# Altium schematic sheet Measuring.SchDoc
size B; SheetNumber: 2; SheetTotal: 2
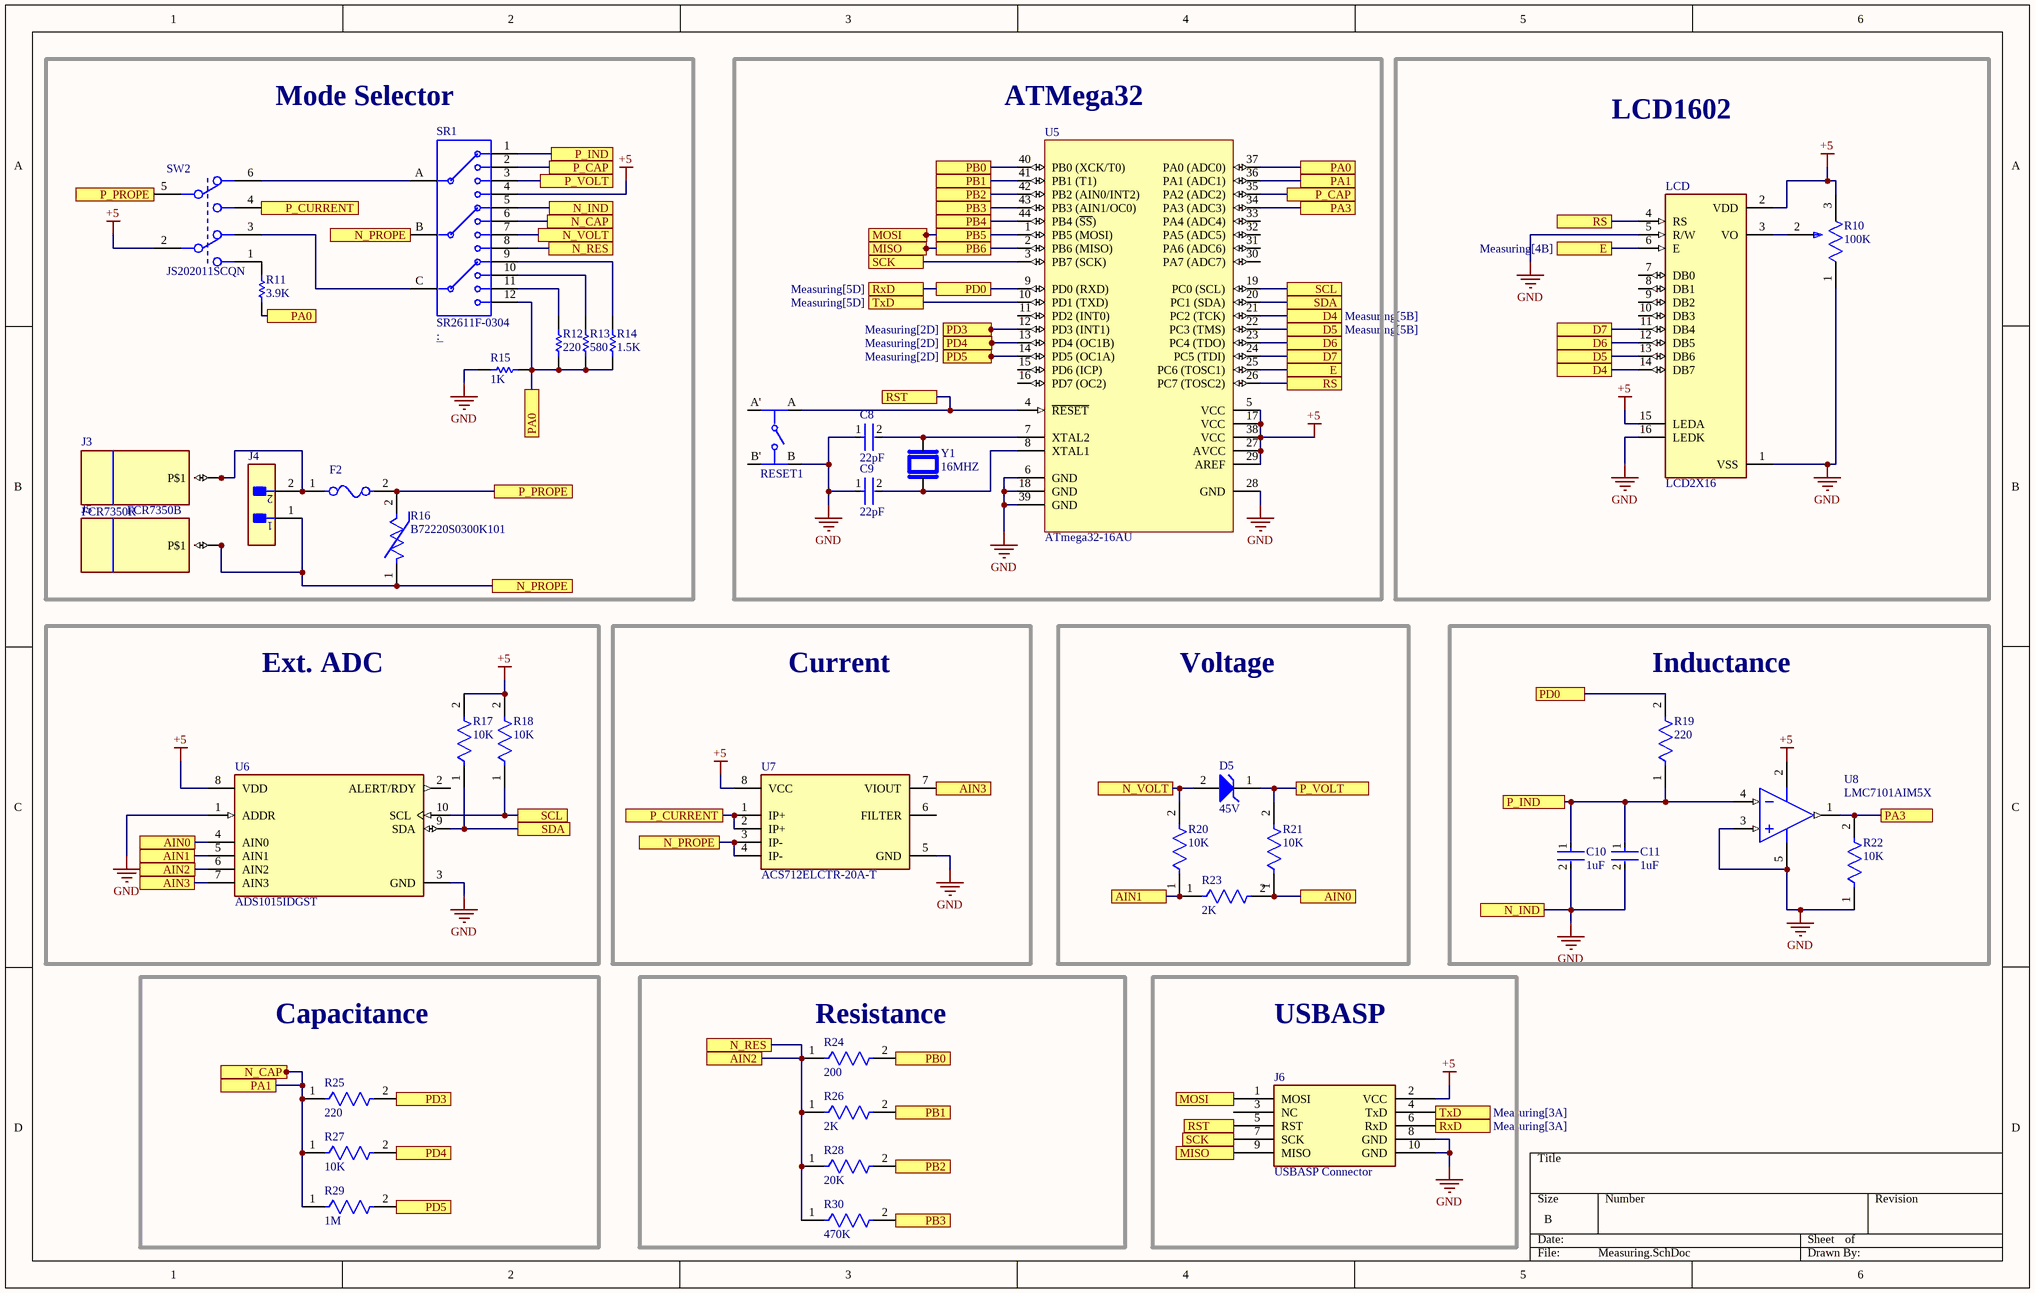
[diagram p0: Measuring.SchDoc]

## Parts
C8  22pF  [FP-C0603C-CF-MFG]
C9  22pF  [FP-C0603C-CF-MFG]
C10  1uF  [FP-0603-L_1_6_0_1-W_0_8_0-IPC_A]
C11  1uF  [FP-0603-L_1_6_0_1-W_0_8_0-IPC_A]
D5  45V  [ONSC-SOD-123-2-425-04_V]
F2  0154004.DR  [FP-0154-MFG]  (value not drawn)
J3  FCR7350R  [FCR7350R]
J4  B2B-XH-A(LF)(SN)  [FP-B2B-XH-A_LF_SN-MFG]  (value not drawn)
J5  FCR7350B  [FCR7350B]
J6  USBASP Connector  [SHDR10W99P254_2X5_2032X889X927P]
LCD  LCD2X16  [LCD_LCD2X16]
R10  100K  [FP-3269W-MFG]
R11  3.9K  [RESC1608X55X25ML10T15]
R12  220  [RESC1608X55X25ML10T15]
R13  580  [RESC1608X55X25ML10T15]
R14  1.5K  [RESC1608X55X25ML10T15]
R15  1K  [RESC1608X55X25ML10T15]
R16  B72220S0300K101  [FP-B72220S0-MFG]
R17  10K  [FP-RC0603-0_55-IPC_C]
R18  10K  [FP-RC0603-0_55-IPC_C]
R19  220  [FP-RC0603-0_55-IPC_C]
R20  10K  [FP-RC0603-0_55-IPC_C]
R21  10K  [FP-RC0603-0_55-IPC_C]
R22  10K  [FP-RC0603-0_55-IPC_C]
R23  2K  [FP-RC0603-0_55-IPC_C]
R24  200  [FP-RC0603-0_55-IPC_C]
R25  220  [FP-RC0603-0_55-IPC_C]
R26  2K  [FP-RC0603-0_55-IPC_C]
R27  10K  [FP-RC0603-0_55-IPC_C]
R28  20K  [FP-RC0603-0_55-IPC_C]
R29  1M  [FP-RC0603-0_55-IPC_C]
R30  470K  [FP-RC0603-0_55-IPC_C]
RESET1  EVQ-Q2B02W  [FP-EVQ-Q2B02W-MFG]  (value not drawn)
SR1  SR2611F-0304  [SW_A30403RNCQ]
SW2  JS202011SCQN  [FP-JS202011SCQN-MFG]
U5  ATmega32-16AU  [44A_N]
U6  ADS1015IDGST  [FP-DGS0010A-MFG]
U7  ACS712ELCTR-20A-T  [FP-LC-8-IPC_C]
U8  LMC7101AIM5X  [DBV0005A_L]
Y1  16MHZ  [XTAL_NX5032GA-16.000000MHZ-LN-CD-1]

## Blocks framed on the sheet
Mode Selector: F2 J3-J5 R11-R16 SR1 SW2
ATMega32: C8 C9 RESET1 U5 Y1
LCD1602: LCD R10
Ext. ADC: R17 R18 U6
Current: U7
Voltage: D5 R20 R21 R23
Inductance: C10 C11 R19 R22 U8
Capacitance: R25 R27 R29
Resistance: R24 R26 R28 R30
USBASP: J6

## Ports
AIN0 (see Measuring[1C]), AIN0 (see Measuring[4C]), AIN1 (see Measuring[1C]), AIN1 (see Measuring[4C]), AIN2 (see Measuring[1C]), AIN2 (see Measuring[3D]), AIN3 (see Measuring[1C]), AIN3 (see Measuring[3C]), D4 (see Measuring[4A]), D4 (see Measuring[5B]), D5 (see Measuring[4B]), D5 (see Measuring[5B]), D6 (see Measuring[4B]), D6 (see Measuring[5B]), D7 (see Measuring[4B]), D7 (see Measuring[5B]), E (see Measuring[4B]), E (see Measuring[5A]), MISO (see Measuring[3A]), MISO (see Measuring[4D]), MOSI (see Measuring[3A]), MOSI (see Measuring[4D]), N_CAP (see Measuring[1D]), N_CAP (see Measuring[2A]), N_IND (see Measuring[2A]), N_IND (see Measuring[5C]), N_PROPE (see Measuring[1A], Measuring[2B]), N_PROPE (see Measuring[1A], Measuring[2C]), N_PROPE (see Measuring[2B], Measuring[2C]), N_RES (see Measuring[2A]), N_RES (see Measuring[3D]), N_VOLT (see Measuring[2A]), N_VOLT (see Measuring[4C]), P_CAP (see Measuring[2A]), P_CAP (see Measuring[4A]), P_CURRENT (see Measuring[1A]), P_CURRENT (see Measuring[2C]), P_IND (see Measuring[2A]), P_IND (see Measuring[5C]), P_PROPE (see Measuring[1A]), P_PROPE (see Measuring[2B]), P_VOLT (see Measuring[2A]), P_VOLT (see Measuring[4C]), PA0 (see Measuring[1A], Measuring[2B]), PA0 (see Measuring[1A], Measuring[4A]), PA0 (see Measuring[2B], Measuring[4A]), PA1 (see Measuring[1D]), PA1 (see Measuring[4A]), PA3 (see Measuring[4A]), PA3 (see Measuring[6C]), PB0 (see Measuring[3A]), PB0 (see Measuring[3D]), PB1 (see Measuring[3A]), PB1 (see Measuring[3D]), PB2 (see Measuring[3A]), PB2 (see Measuring[3D]), PB3 (see Measuring[3A]), PB3 (see Measuring[3D]), PB4, PB5, PB6, PD0 (see Measuring[3A]), PD0 (see Measuring[5C]), PD3 (see Measuring[2D]), PD3 (see Measuring[3B]), PD4 (see Measuring[2D]), PD4 (see Measuring[3B]), PD5 (see Measuring[2D]), PD5 (see Measuring[3B]), RS (see Measuring[4B]), RS (see Measuring[5A]), RST (see Measuring[3B]), RST (see Measuring[4D]), RxD (see Measuring[3A]), RxD (see Measuring[5D]), SCK (see Measuring[3A]), SCK (see Measuring[4D]), SCL (see Measuring[2C]), SCL (see Measuring[4A]), SDA (see Measuring[2C]), SDA (see Measuring[4A]), TxD (see Measuring[3A]), TxD (see Measuring[5D])

## Nets
+5: J6.2(VCC) LCD.2(VDD) LCD.15(LEDA) R10.3(CW) R17.2 R18.2 SR1.4 SW2.2 U5.5(VCC) U5.17(VCC) U5.27(AVCC) U5.29(AREF) U5.38(VCC) U6.8(VDD) U7.8(VCC) U8.2(V+)
GND: C8.1 C9.1 C10.2 C11.2 J6.8(GND) J6.10(GND) LCD.1(VSS) LCD.5(R/W) LCD.16(LEDK) R10.1(CCW) R15.1 R22.1 RESET1.B SR1.5 U5.6(GND) U5.18(GND) U5.28(GND) U5.39(GND) U6.1(ADDR) U6.3(GND) U7.5(GND) U8.3(IN+) U8.5(V-) ; port N_IND
AIN0: R21.1 R23.2 U6.4(AIN0) ; port AIN0
AIN1: R20.1 R23.1 U6.5(AIN1) ; port AIN1
AIN2: R24.1 R26.1 R28.1 R30.1 SR1.8 U6.6(AIN2) ; port N_RES, port AIN2
AIN3: U6.7(AIN3) U7.7(VIOUT) ; port AIN3
D4: LCD.14(DB7) U5.21(PC2_(TCK)) ; port D4
D5: LCD.13(DB6) U5.22(PC3_(TMS)) ; port D5
D6: LCD.12(DB5) U5.23(PC4_(TDO)) ; port D6
D7: LCD.11(DB4) U5.24(PC5_(TDI)) ; port D7
E: LCD.6(E) U5.25(PC6_(TOSC1)) ; port E
MISO: J6.9(MISO) U5.2(PB6_(MISO)) ; port PB6, port MISO
MOSI: J6.1(MOSI) U5.1(PB5_(MOSI)) ; port PB5, port MOSI
N_CAP: R25.1 R27.1 R29.1 SR1.6 U5.36(PA1_(ADC1)) ; port N_CAP, port PA1
N_PROPE: J4.1 J5.P$1 J5.P$2(P$1) J5.P$3(P$1) J5.P$4(P$1) J5.P$5(P$1) R16.1 SR1.B U7.3(IP-) U7.4(IP-) ; port N_PROPE
N_VOLT: D5.2(A) R20.2 SR1.7 ; port N_VOLT
P_CAP: SR1.2 U5.35(PA2_(ADC2)) ; port P_CAP
P_CURRENT: SW2.4 U7.1(IP+) U7.2(IP+) ; port P_CURRENT
P_IND: C10.1 C11.1 R19.1 SR1.1 U8.4(IN-) ; port P_IND
P_PROPE: F2.2 R16.2 SW2.5 ; port P_PROPE
P_VOLT: D5.1(K) R21.2 SR1.3 ; port P_VOLT
PA0: R11.2 R12.2 R13.2 R14.2 R15.2 SR1.12 U5.37(PA0_(ADC0)) ; port PA0
PA3: R22.2 U5.34(PA3_(ADC3)) U8.1(OUT) ; port PA3
PB0: R24.2 U5.40(PB0_(XCK/T0)) ; port PB0
PB1: R26.2 U5.41(PB1_(T1)) ; port PB1
PB2: R28.2 U5.42(PB2_(AIN0/INT2)) ; port PB2
PB3: R30.2 U5.43(PB3_(AIN1/OC0)) ; port PB3
PB4: U5.44(PB4_(~{SS})) ; port PB4
PD0: J6.6(RxD) R19.2 U5.9(PD0_(RXD)) ; port PD0, port RxD
PD3: R25.2 U5.12(PD3_(INT1)) ; port PD3
PD4: R27.2 U5.13(PD4_(OC1B)) ; port PD4
PD5: R29.2 U5.14(PD5_(OC1A)) ; port PD5
RS: LCD.4(RS) U5.26(PC7_(TOSC2)) ; port RS
RST: J6.5(RST) RESET1.A U5.4(~{RESET}) ; port RST
SCK: J6.7(SCK) U5.3(PB7_(SCK)) ; port SCK
SCL: R18.1 U5.19(PC0_(SCL)) U6.10(SCL) ; port SCL
SDA: R17.1 U5.20(PC1_(SDA)) U6.9(SDA) ; port SDA
TxD: J6.4(TxD) U5.10(PD1_(TXD)) ; port TxD
NetC8_2: C8.2 U5.7(XTAL2) Y1.2
NetC9_2: C9.2 U5.8(XTAL1) Y1.1
NetF2_1: F2.1 J3.P$1 J3.P$2(P$1) J3.P$3(P$1) J3.P$4(P$1) J3.P$5(P$1) J4.2
NetLCD_3: LCD.3(VO) R10.2(WIPER)
NetR11_1: R11.1 SW2.1
NetR12_1: R12.1 SR1.11
NetR13_1: R13.1 SR1.10
NetR14_1: R14.1 SR1.9
NetSR1_A: SR1.A SW2.6
NetSR1_C: SR1.C SW2.3

Not connected (* = marked no-connect by the designer): J6 3(NC); LCD 7(DB0) 8(DB1) 9(DB2) 10(DB3); RESET1 A' B'; U5 11(PD2_(INT0)) 15(PD6_(ICP)) 16(PD7_(OC2)) 30(PA7_(ADC7)) 31(PA6_(ADC6)) 32(PA5_(ADC5)) 33(PA4_(ADC4)); U6 2(ALERT/RDY); U7 6(FILTER)

## Library data of the parts
C8 C9 = CMP-2006-03119-3: Cap Ceramic 22pF 50V C0G 5% SMD 0603 125°C Paper T/R; Manufacturer Part Number: C0603C220J5GACTU; Manufacturer: KEMET; Temperature Coefficient: 30ppm/°C; Automotive Grade: Grade 1; Tolerance: 0.05; RoHS: TRUE; Temperature Characteristic: C0G; Capacitance: 22 pF; Device Class L3: Ceramic Capacitors; Digikey Description: Cap Ceramic 22pF 50V C0G 5% SMD 0603 125°C Paper T/R; ComponentLink2URL: https://api.kemet.com/component-edge/download/datasheet/C0603C100J5GACAUTO.pdf; ComponentLink2Description: Datasheet; Automotive: Yes; Temperature: -55°C to +125°C; Temperature Range High: +125°C; Package: C0603C-CF; Device Class L1: Passive Components; Device Class L2: Capacitors; Lead Free: Yes; Value: 22 pF; Category: Cap; Mouser Description: Cap Ceramic 22pF 50V C0G 5% SMD 0603 125°C Paper T/R; Voltage Rating: 50 V; Height: 0.87mm; Material: Ceramic; Temperature Range Low: -55°C; Octopart: https://octopart.com/c0603c220j5gactu-kemet-98525
C10 C11 = CMP-2000-05447-3: None; Tolerance: 10%; Voltage Rating: 50V; Dielectric: X5R; Height: 0.8mm; Depth: 0.8mm; Number of Pins: 2; Length: 1.6mm; Thickness: 0.035inch; Contact Plating: Nickel; Radiation Hardening: No; Package Quantity: 1; Case/Package: 0603; Capacitance: 1uF; Halogen Free: Halogen Free; RoHS Compliant: Yes; Termination: SMD/SMT; Max Operating Temperature: 85°C; Min Operating Temperature: -55°C; Case Code (Metric): 1608; Construction: Flat; Voltage Rating (DC): 50V; Packaging: Tape and Reel; Series: M; Case Code (Imperial): 0603; Width: 0.031inch; Mount: Surface Mount
D5 = CMP-1060-00318-1: Zener Voltage Regulator, 500 mW, 2-Pin SOD-123, Pb-Free, Tape and Reel; Manufacturer: On Semiconductor; PartNumber: MMSZ4713T1G; P Max (W): 0.5; VZ Typ (V): 30; PackageVersion: Rev. G, 10/2009; Mounting Technology: Surface Mount; ComponentLink3URL: http://www.onsemi.com/pub_link/Collateral/425-04.PDF; ComponentLink3Description: Package Specification; ComponentLink1Description: Manufacturer URL; PackageReference: SOD-123-2-425-04; ComponentLink2Description: Datasheet; DatasheetVersion: Rev. 9; RoHS: Pb-Free; Packing: Tape and Reel; ComponentLink2URL: http://www.onsemi.com/pub_link/Collateral/MMSZ4678T1-D.PDF; ComponentLink1URL: http://www.onsemi.com/; PackageDescription: 2-Pin SOD, Body 1.6 x 2.69 mm
F2 = CMP-08605-000003-1: FUSE BRD MNT 4A 125VAC/VDC 2SMD; Manufacturer: Littelfuse; Fuse Blow Speed: Fast; Max Fuse Ac Voltage: 125V; Lead Free: Yes; Device Class L3: unset; Manufacturer Part Number: 0154004.DR; Device Class L2: Fuses; Package: 0154; ComponentLink2Description: Datasheet; Temperature Range Low: -55°C; Temperature Range High: +125°C; Device Class L1: Circuit Protection; Height: 3.81mm; Temperature: -55°C to +125°C; Mouser Description: Surface Mount Fuses Fuseblock w/ fuse 4A OMNI BLOK 154; Automotive: No; Digikey Description: FUSE BRD MNT 4A 125VAC/VDC 2SMD; RoHS: TRUE; Category: Fuse; Fuse Current: 4A; Max Fuse Dc Voltage: 125V; ComponentLink2URL: https://www.littelfuse.com/~/media/electronics/datasheets/fuses/littelfuse_fuse_154_154t_154l_154tl_datasheet.pdf.pdf; Octopart: https://octopart.com/0154004.dr-littelfuse-565861
J3 = FCR7350R: Banana Jack Connector Standard Banana Solder Red; MF: Cliff; SnapEDA_Link: https://www.snapeda.com/parts/FCR7350R/Cliff+Electronics/view-part/?ref=snap; Package: None; Value: *; MP: FCR7350R; Check_prices: https://www.snapeda.com/parts/FCR7350R/Cliff+Electronics/view-part/?ref=eda
J4 = CMP-2000-05888-3: CONN HEADER VERT 2POS 2.5MM; Current Rating: 3A; Voltage Rating: 250V; Number of Contacts: 2; Contact Resistance: 20mR; Wire/Cable Gauge: 22AWG; Insulation Resistance: 1GR; Connector Type: Male Pin; Packaging: Bulk; Contact Material: Brass; Lead Free: Lead Free; Orientation: Straight; Contact Plating: Tin; Max Current Rating: 3A; Termination: Solder; Fastening Type: Detent; Depth: 5.75mm; Housing Material: Polyamide; REACH SVHC: No SVHC; Series: XH; Voltage Rating (AC): 250V; Number of Positions: 2; Color: Natural; Contact Type: Male Pin; Max Voltage Rating (DC): 250V; Pitch: 2.5mm; Lead Pitch: 2.5mm; Mount: Through Hole; Max Operating Temperature: 85°C; Length: 7.4mm; Max Voltage Rating (AC): 250V; Min Operating Temperature: -25°C; Number of Rows: 1; Housing Color: White
J5 = FCR7350B: Banana Jack Connector Standard Banana Solder Black; MF: Cliff; MP: FCR7350R; SnapEDA_Link: https://www.snapeda.com/parts/FCR7350R/Cliff+Electronics/view-part/?ref=snap; Package: None; Value: *; Check_prices: https://www.snapeda.com/parts/FCR7350R/Cliff+Electronics/view-part/?ref=eda
J6 = USBASP Connector: Connector; Manufacturer_Name: Molex; Manufacturer_Part_Number: 70246-1001; Datasheet Link: http://www.molex.com/pdm_docs/sd/702461001_sd.pdf; Height: 9.27mm; Mouser Part Number: 538-70246-1001; Mouser Price/Stock: https://www.mouser.co.uk/ProductDetail/Molex/70246-1001?qs=L7RdmAxh%252BcP9d7Ope9dnAA%3D%3D
LCD = LCD2X16: Display; Display: LCD 2x16 characters (blue backlight); Price: None; Value: *; MP: LCD2X16; Package: None; Availability: Unavailable
R10 = CMP-07234-000021-1: TRIMMER 100K OHM 0.25W SMD; Manufacturer: Bourns; Manufacturer Part Number: 3269W-1-104LF; Temperature Coefficient: 100ppm/°C; Tolerance: 10%; Resistance: 100kΩ; Value: 100kΩ; Composition: Cermet; Height: 8.96mm; ComponentLink2URL: https://www.bourns.com/docs/Product-Datasheets/3269.pdf; Mouser Description: Res Cermet Trimmer 100K Ohm 10% 1/4W 12(Elec)Turn 1.78mm (6.35 X 6.36 X 8.46mm) Gull Wing SMD Tube; ComponentLink2Description: Datasheet; Temperature Range High: +150°C; Temperature: -65°C to +150°C; Series: 3269; Device Class L1: Passive Components; RoHS: TRUE; Octopart: https://octopart.com/3269w-1-104lf-bourns-114162; Temperature Range Low: -65°C; Device Class L2: Resistors; Digikey Description: TRIMMER 100K OHM 0.25W SMD; Power Rating: 0.25W; Device Class L3: Variable Resistors and Potentiometers; Lead Free: Yes; Package: 3269W; Category: Res; Automotive: No
R11-R14 = CMP-2100-03667-1: Chip Resistor, 0 Ohm, +/- 5%, 0.1 W, -55 to 155 degC, 0603 (1608 Metric), RoHS, Tape and Reel; Manufacturer: Yageo; Temperature Coefficient: 200ppm/degreesC; Voltage Rating: 50V; Power Rating: 100mW; Resistance: 1K; Width: 0.8mm; Max Operating Temperature: 155degC; Tolerance: 5%; Package Reference: 0603; Height: 0.45mm; Depth: 0.8mm; Package Description: 2-Pin Surface Mount Device, Body 1.6 x 0.8 mm; Termination: SMD/SMT; Package Quantity: 5000; Case/Package: 0603; Case Code (Imperial): 0603; Radiation Hardening: No; Number of Pins: 2; Length: 1.6mm; Lead Free: LeadFree; Voltage Rating (DC): 50V; Military Standard: Not; Datasheet URL: http://www.yageo.com/NewPortal/yageodocoutput?fileName=/pdf/R-Chip/PYu-RC_Group_51_RoHS_L_5.pdf; Manufacturer URL: http://www.yageo.com/; Packaging: TapeandReel; Case Code (Metric): 1608; Min Operating Temperature: -55degC; Composition: ThickFilm; RoHSCompliant: true; Contact Plating: Tin; Datasheet Version: Rev. 5, 10/2016; REACH SVHC: NoSVHC
R15 = CMP-2100-03667-1: Chip Resistor, 0 Ohm, +/- 5%, 0.1 W, -55 to 155 degC, 0603 (1608 Metric), RoHS, Tape and Reel; Manufacturer: Yageo; Temperature Coefficient: 200ppm/degreesC; Voltage Rating: 50V; Power Rating: 100mW; Width: 0.8mm; Max Operating Temperature: 155degC; Tolerance: 5%; Package Reference: 0603; Height: 0.45mm; Depth: 0.8mm; Package Description: 2-Pin Surface Mount Device, Body 1.6 x 0.8 mm; Termination: SMD/SMT; Package Quantity: 5000; Case/Package: 0603; Case Code (Imperial): 0603; Radiation Hardening: No; Number of Pins: 2; Length: 1.6mm; Lead Free: LeadFree; Voltage Rating (DC): 50V; Military Standard: Not; Datasheet URL: http://www.yageo.com/NewPortal/yageodocoutput?fileName=/pdf/R-Chip/PYu-RC_Group_51_RoHS_L_5.pdf; Resistance: 1K; Manufacturer URL: http://www.yageo.com/; Packaging: TapeandReel; Case Code (Metric): 1608; Min Operating Temperature: -55degC; Composition: ThickFilm; RoHSCompliant: true; Contact Plating: Tin; Datasheet Version: Rev. 5, 10/2016; REACH SVHC: NoSVHC
R16 = CMP-10618-000002-1: VARISTOR 45VAC 2KA DISC 20MM; Manufacturer: EPCOS; Voltage Rating Dc: 38V; Clamping Voltage: 93V; Clamping Current: 20A; Capacitance: 9350pF; Voltage Rating Ac: 30V; Varistor Voltage: 47V; Value: 9350pF; Voltage Tolerance: 10%; ComponentLink2URL: https://www.tdk-electronics.tdk.com/inf/70/db/var/SIOV_Leaded_StandarD.pdf; Category: Res; Device Class L1: Circuit Protection; ComponentLink2Description: Datasheet; Mouser Description: Epcos Standard Series Metal Oxide Varistor 9.35nF 20A; Clamping 93V; Varistor 47V; Device Class L3: unset; Package: B72220S0; Manufacturer Part Number: B72220S0300K101; RoHS: TRUE; Octopart: https://octopart.com/b72220s0300k101-epcos-10532994; Height: 25.5mm; Temperature: -40°C to +105°C; Temperature Range High: +105°C; Temperature Range Low: -40°C; Lead Free: Yes; Digikey Description: VARISTOR 47V 2KA DISC 20MM; Device Class L2: Varistors; Automotive: No
R17 R18 R20 R21 R23-R30 = CMP-2100-03664-2: RES 10K OHM 1% 1/10W 0603; Voltage Rating: 75V; Voltage Rating (DC): 50V; Resistance: 10kR; Power Rating: 100mW; Temperature Coefficient: 100ppm/°C; Depth: 0.8mm; Termination: SMD/SMT; Resistor Type: Thick Film; Series: RC; Construction: Rectangular; Features: Moisture Resistant; Packaging: Tape and Reel; Min Operating Temperature: -55°C; Number of Terminations: 2; Lead Pitch: 0.3mm; RoHS Compliant: Yes; Case/Package: 0603; Resistance Tolerance: 1%; Military Standard: Not; Weight: 7.1E-05oz; Number of Pins: 2; Tolerance: 1%; Length: 1.6mm; Case Code (Imperial): 0603; Lead Free: Lead Free; Width: 0.8mm; Max Power Dissipation: 100mW; Height: 0.45mm; Max Operating Temperature: 155°C; Case Code (Metric): 1608; Size Code: 0603
R19 = CMP-2100-03664-2: RES 10K OHM 1% 1/10W 0603; Voltage Rating: 75V; Voltage Rating (DC): 50V; Resistance: 220R; Power Rating: 100mW; Temperature Coefficient: 100ppm/°C; Depth: 0.8mm; Termination: SMD/SMT; Resistor Type: Thick Film; Series: RC; Construction: Rectangular; Features: Moisture Resistant; Packaging: Tape and Reel; Min Operating Temperature: -55°C; Number of Terminations: 2; Lead Pitch: 0.3mm; RoHS Compliant: Yes; Case/Package: 0603; Resistance Tolerance: 1%; Military Standard: Not; Weight: 7.1E-05oz; Number of Pins: 2; Tolerance: 1%; Length: 1.6mm; Case Code (Imperial): 0603; Lead Free: Lead Free; Width: 0.8mm; Max Power Dissipation: 100mW; Height: 0.45mm; Max Operating Temperature: 155°C; Case Code (Metric): 1608; Size Code: 0603
R22 = CMP-2100-03664-2: RES 10K OHM 1% 1/10W 0603; Voltage Rating: 75V; Voltage Rating (DC): 50V; Resistance: 10KR; Power Rating: 100mW; Temperature Coefficient: 100ppm/°C; Depth: 0.8mm; Termination: SMD/SMT; Resistor Type: Thick Film; Series: RC; Construction: Rectangular; Features: Moisture Resistant; Packaging: Tape and Reel; Min Operating Temperature: -55°C; Number of Terminations: 2; Lead Pitch: 0.3mm; RoHS Compliant: Yes; Case/Package: 0603; Resistance Tolerance: 1%; Military Standard: Not; Weight: 7.1E-05oz; Number of Pins: 2; Tolerance: 1%; Length: 1.6mm; Case Code (Imperial): 0603; Lead Free: Lead Free; Width: 0.8mm; Max Power Dissipation: 100mW; Height: 0.45mm; Max Operating Temperature: 155°C; Case Code (Metric): 1608; Size Code: 0603
RESET1 = CMP-05618-000078-1: SWITCH TACTILE SPST-NO 0.02A 15V; Contact Resistance: 100mR; Illumination Type: Non-Illuminated; Electrical Life: 2000000Cycles; Voltage Rating (AC): 250V; Throw Configuration: SPST; Contact Current Rating: 20mA; Actuator Type: Standard; Switch Function: Off-Mom; Switch Travel: 0.2mm; Operating Force: 0.5N; Actuator Length: 0.7mm; Actuator Color: White; Package Quantity: 1; Min Operating Temperature: -40°C; Voltage Rating (DC): 15V; Mechanical Life: 2000000Cycles; Radiation Hardening: No; Thickness: 1.8mm; Mount: Surface Mount; Current Rating: 20mA; Case/Package: SMD/SMT; Max Operating Temperature: 85°C; Series: EVQQ2; Lead Free: Lead Free; Termination: SMD/SMT; Packaging: Tape and Reel; Orientation: Straight; RoHS Compliant: Yes; Size: 1.8mm; Contact Plating: Silver; Color: White; Max Voltage Rating (DC): 15V
SR1 = SR2611F-0304: Rotary Switch 4 Position 3P4T 2.5A (AC), 350mA (DC) 125VAC Panel Mount, Through Hole; MP: A30403RNCQ; MF: C&K; SnapEDA_Link: https://www.snapeda.com/parts/A30403RNCQ/C&K/view-part/438327/?ref=snap; Availability: Unavailable; Package: None; Price: None; Value: *
SW2 = CMP-2000-05087-3: SWITCH SLIDE DPDT 300MA 6V; Switch Function: On-On; Actuator Type: Standard; Switch Travel: 2mm; Actuator Color: Black; Contact Resistance: 70mR; Electrical Life: 5000Cycles; Actuator Material: Nylon; REACH SVHC: No SVHC; Series: JS; Min Operating Temperature: -20°C; Depth: 7.5mm; Housing Material: Nylon; Voltage Rating (DC): 6V; Max Operating Temperature: 85°C; Contact Current Rating: 300mA; Package Quantity: 1; Contact Plating: Silver; Contact Material: Copper Alloy; Throw Configuration: DPDT; Current Rating: 300mA; Orientation: Vertical; Max Current Rating: 300mA; Max Voltage Rating (DC): 6V; Flammability Rating: UL94 V-2; Length: 9mm; Packaging: Tape and Reel; Mount: Surface Mount; Actuator Length: 2mm; Lead Free: Lead Free; Termination: Gull Wing; Radiation Hardening: No
U5 = CMP-0095-00554-1: 8-bit AVR Microcontroller, 4.5-5.5V, 16MHz, 32KB Flash, 1024 Bytes EEPROM, 2KB SRAM, 44-pin TQFP, Industrial Grade (-40°C to 85°C); ComponentLink1URL: http://www.atmel.com/; Code_JEDEC: MS-026-ACB; PackageDescription: 44-Pin Plastic Thin Profile Quad Flat Pack, 10 x 10 x 1.0 mm Body, 0.8 mm Pitch (TQFP); ComponentLink2Description: ATmega32(L) Datasheet; ComponentLink3URL: http://atmel.com/dyn/resources/prod_documents/2503S.pdf; PackageVersion: revC, Oct-2010; ComponentLink1Description: Manufacturer URL; ComponentLink3Description: ATmega32(L) Summary; ComponentLink2URL: http://atmel.com/dyn/resources/prod_documents/doc2503.pdf; PackageReference: 44A; DatasheetVersion: revQ, Feb-2011
U6 = CMP-0003-00377-3: IC ADC 12BIT SIGMA-DELTA 10VSSOP; Supply Type: Single; Number of Converters: 1; Number of Bits: 12; Number of Inputs: 4; Sampling Rate: 3.3KS/s; Conversion Rate: 3300S/s; Min Supply Voltage: 2V; Interface: I2C; Operating Supply Voltage: 3.3V; Polarity: Bipolar; Nominal Supply Current: 150uA; Integral Nonlinearity (INL): 0.5LSB; Max Power Dissipation: 900uW; Max Supply Voltage (DC): 5.5V; Resolution: 12b; Width: 3mm; Min Operating Temperature: -40°C; Contact Plating: Gold; Number of A/D Converters: 1; Max Operating Temperature: 125°C; Height: 1.02mm; Case/Package: VSSOP; Package Quantity: 250; Number of Elements: 1; Lead Free: Lead Free; Number of Pins: 10; Radiation Hardening: No; Termination: SMD/SMT; Length: 3mm; Min Supply Voltage (DC): 2V; Power Dissipation: 900uW; Number of Channels: 4; Max Supply Voltage: 5.5V; REACH SVHC: No SVHC; Packaging: Tape and Reel
U7 = CMP-0826-00001-2: SENSOR CURRENT HALL 20A AC/DC; Accuracy: 1.5%; Quiescent Current: 10mA; Response Time: 5us; Sensitivity: 100mV/A; Min Supply Voltage: 4.5V; Number of Channels: 1; Polarity: Bidirectional; Frequency: 80kHz; Max Supply Current: 13mA; Operating Supply Voltage: 5V; Max Supply Voltage: 5.5V; Max Operating Temperature: 85°C; Case/Package: SOIC; REACH SVHC: No SVHC; Min Operating Temperature: -40°C; Current Sensing: 20A; Packaging: Tape and Reel; Lead Free: Lead Free; Series: -; Length: 4.9mm; Number of Pins: 8; Linearity: 1.5%; Radiation Hardening: No; Package Quantity: 1; Termination: SMD/SMT; Output Current: 10mA; Height: 1.5mm; RoHS Compliant: Yes; Width: 3.9mm; Bandwidth: 80kHz
U8 = CMP-0055-01331-3: Tiny Low Power Operational Amplifier with Rail-to-Rail Input and Output, 5-pin SOT-23; Manufacturer: Texas Instruments; CompType: Amplifiers; PowerWise: N; PackageTopMarking: A00A*XTT; Package Reference: DBV0005A; ComponentLink1URL: http://www.ti.com/general/docs/lit/getliterature.tsp?genericPartNumber=LMC7101&fileType=pdf; ComponentLink1Description: Datasheet URL; RoHS: N; PackageDescription: Molded SOT-23, .115 x .063 x .040 in Body, 5 Lead, .0375 in Pitch; PinCount: 5
Y1 = NX5032GA-16.000000MHZ-LN-CD-1: Package: None; Price: None; Availability: Unavailable; MP: NX5032GA-16.000000MHZ-LN-CD-1; Value: *